# EAGLE design LM2596ADJ (EAGLE 6.4)
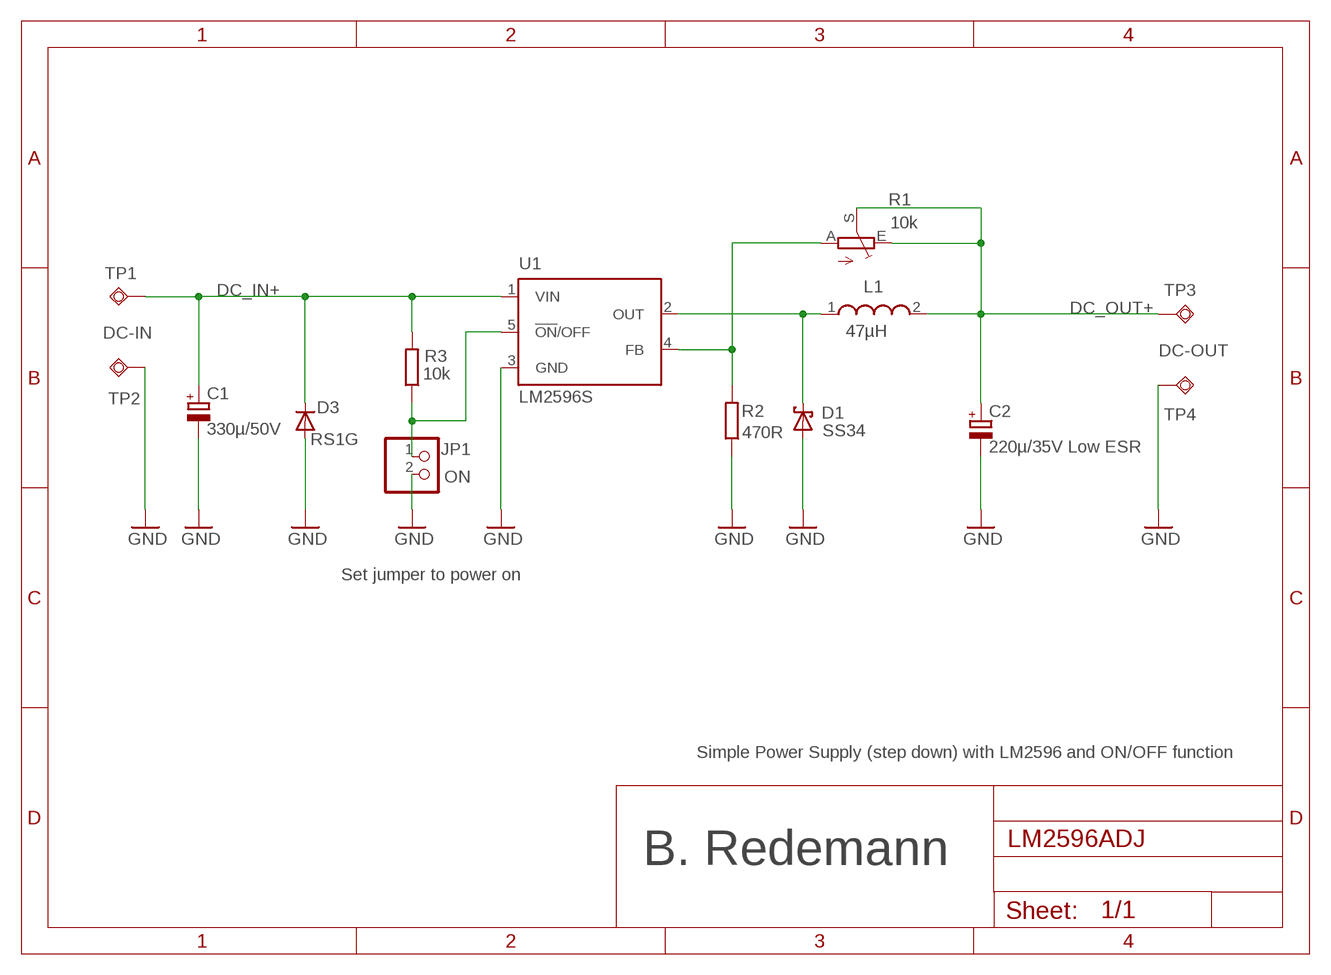
[diagram p0: schematic, sheet 1]

## Parts
C1  330µ/50V  CPOL-EUG  [PANASONIC_G]
C2  220µ/35V Low ESR  CPOL-EUF  [PANASONIC_F]
D1  SS34  SCHOTTKY-DIODESMD  [SMB]
D3  RS1G  DIODE-DO214AC  [DO214AC]
JP1  ON  PINHD-1X2  [1X02]
L1  47µH  WE-PD_1260/1245/1280/1210  [WE-PD_1260/1245/1280/1210]
R1  10k  TRIM_EU-RJ9W  [RJ9W]
R2  470R  R-EU_M0805  [M0805]
R3  10k  R-EU_M0805  [M0805]
TP1  DC_IN  TPSQPAD1-13Y  [P1-13Y]
TP2  GND  TPSQPAD1-13Y  [P1-13Y]
TP3  DC_OUT  TPSQPAD1-13Y  [P1-13Y]
TP4  GND  TPSQPAD1-13Y  [P1-13Y]
U1  LM2596S  [TO263-5]

## Nets
DC_IN+: C1.+ D3.C R3.2 TP1.TP U1.1(VIN)
DC_OUT+: C2.+ L1.2 R1.E R1.S TP3.TP
GND: C1.- C2.- D1.A D3.A JP1.2 R2.1 TP2.TP TP4.TP U1.3(GND)
N$1: D1.C L1.1 U1.2(OUT)
N$4: R1.A R2.2 U1.4(FB)
N$5: JP1.1 R3.1 U1.5(!ON!/OFF)

## Notes on the sheet
- DC-IN
- DC-OUT
- Set jumper to power on
- Simple Power Supply (step down) with LM2596 and ON/OFF function
- B. Redemann

## Library data of the parts
C1 = rcl:CPOL-EU: POLARIZED CAPACITOR, European symbol; MF: Panasonic; MFN: EEVFK1H221P
C2 = rcl:CPOL-EU: POLARIZED CAPACITOR, European symbol; MF: Panasonic; MFN: EINTRAGEN!
D1 = diode:SCHOTTKY-DIODE: Schottky Diode
D3 = diode:DIODE-: DIODE; MF: multicomp; MFN: RS1G; OC_FARNELL: 4085035
JP1 = pinhead:PINHD-1X2: PIN HEADER
L1 = Wurth_Elektronik_Passive_rev15b:WE-PD: SMD Shielded Power Inductor Characteristics Magnetically shielded version which results in a low leakage field High Saturation currents up to 25 A Very low self-losses at high switching frequency‘s Wide inductances spectrum available at all sizes Operating temperature: –40 °C to +125 °C Applications Perfectly suitable for switching regulators with extremely high efficiency Integrated DC/DC- converter Switching regulators with low operating voltages (Graphic cards, embedded PC-Cards, Mainboards) Plastic base: Because of the one piece construction these are more suitable for high vibration or shock applications <http://katalog.we-online.de/media/images/eisos/FePBF_pf2.jpg> Details see: http://katalog.we-online.de/en/pbs/WE-PD? Updated by Dan Xu 2014-07-08 2014 (C) Wurth Elektronik; MF: Wuerth
R1 = pot:TRIM_EU-: POTENTIOMETER
R2 R3 = rcl:R-EU_: RESISTOR, European symbol
TP1-TP4 = testpad:TPSQ: Test pad
U1 = national-semiconductor:LM2596: SIMPLE SWITCHER® Power Converter 150 kHz 3A Step-Down Voltage Regulator Source: http://www.national.com/ds/LM/LM2596.pdf; MF: NATIONAL SEMICONDUCTOR; MPN: LM2596S-ADJ/NOPB; OC_FARNELL: 9494367; OC_NEWARK: 41K3842

## Board
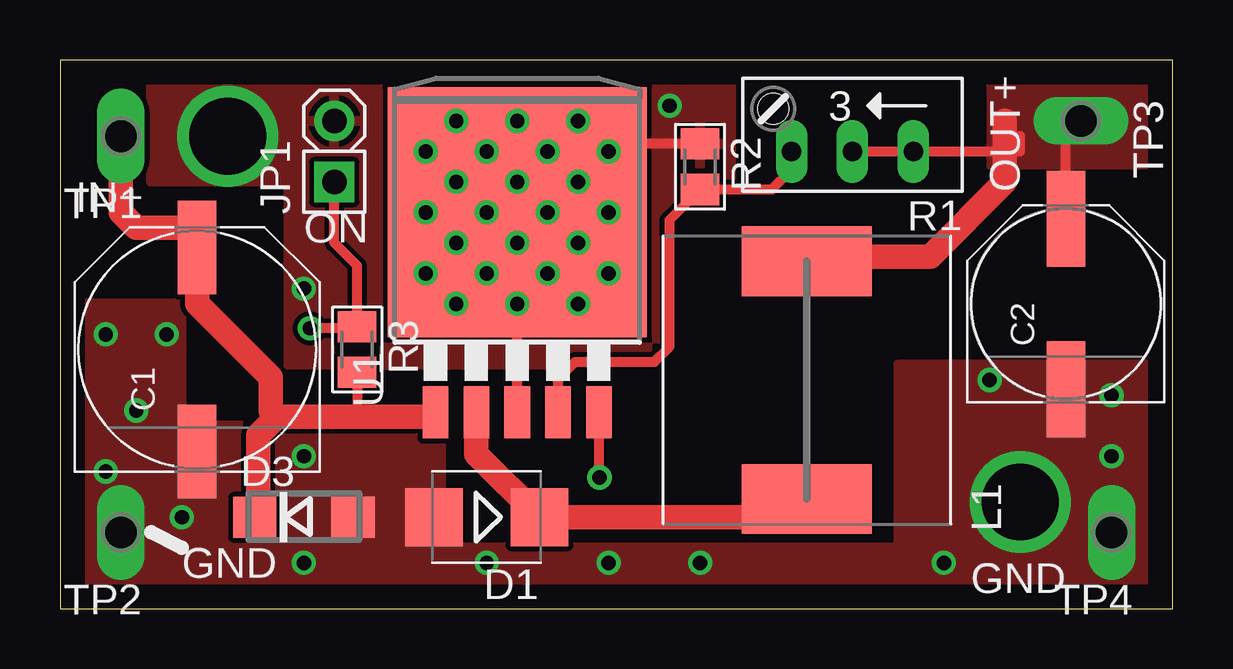
[diagram p1: board, top side]
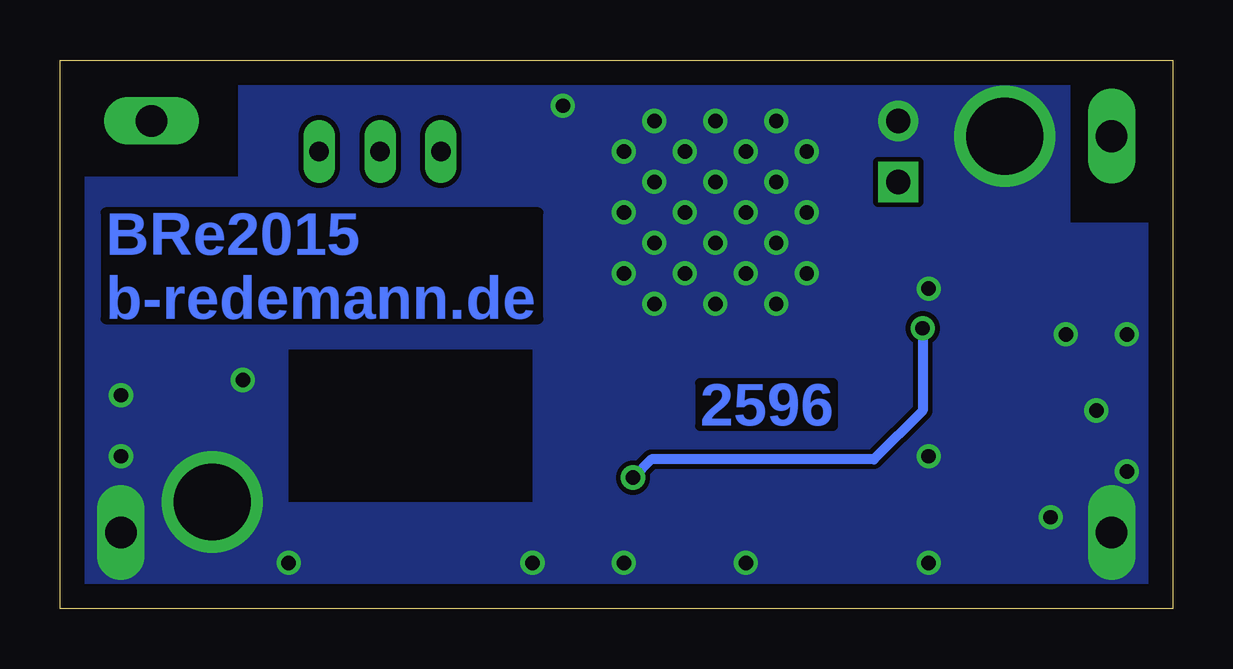
[diagram p2: board, bottom side, seen from below]

Size 46.35 x 22.86 mm. Coordinates in mm from the lower left corner, seen from the top.
Outline: 0,0 46.35,0 46.35,22.86 0,22.86 0,0
Copper layers (1*16): Top 0.035mm / dielectric 1.5mm / Bottom 0.035mm
Design rules "default *": minimum track width 10mil, minimum drill 0.6mm, track to track 8mil, track to pad 8mil, pad to pad 8mil, via to via 8mil, smd to smd 8mil, copper to edge 40mil, drill to drill 8mil, minimum pad ring 10mil, minimum via ring 8mil, stop-mask expansion 4mil, vias tented up to drill 0mil, thermal gap 10mil
bRestrict: area 26.7,4.4 to 36.8,10.8

### Footprints (pad centres in the part's own frame; a part is rotated, then mirrored left to right if it is on the bottom)
PANASONIC_G = smd 3.9 x 1.6: + 4.25,0; - -4.25,0
PANASONIC_F = smd 4 x 1.6: + 3.55,0; - -3.55,0
SMB = smd 2.4 x 2.4: A 2.2,0; C -2.2,0
DO214AC = smd 1.8 x 1.7: A 2.05,0; C -2.05,0
1X02 = drill 1.016 pad 1.676 square: 1 -1.27,0 | drill 1.016 pad 1.676: 2 1.27,0
WE-PD_1260/1245/1280/1210 = smd 2.9 x 5.4: 1 -4.95,0; 2 4.95,0
RJ9W = drill 0.813 long: A 2.54,0.635; E -2.54,0.635; S 0,0.635
M0805 = smd 1.3 x 1.6: 1 -0.95,0; 2 0.95,0
P1-13Y = drill 1.321 pad 1.905 long: TP 0,0
TO263-5 = smd 1.067 x 2.159: 1 -3.404,-5.791; 2 -1.702,-5.791; 3 0,-5.791; 4 1.702,-5.791; 5 3.404,-5.791 | smd 10.8 x 10.41: GND 0,2.54

### Placement (x,y rotation side)
C1  5.71,10.79 90 top
C2  41.91,12.7 90 top
D1  17.78,3.81 180 top
D3  10.16,3.81 0 top
JP1  11.43,19.05 90 top
L1  31.11,9.53 90 top
R1  33.02,19.68 180 top
R2  26.67,18.41 270 top
R3  12.38,10.79 270 top
TP1  2.54,19.68 180 top
TP2  2.54,3.17 180 top
TP3  42.55,20.32 270 top
TP4  43.81,3.17 180 top
U1  19.05,13.97 0 top

### Tracks (layer width: path | path; a pad name or v marks a point on that pad's centre or on a via)
DC_IN+
  Top 0.406: R3.2 12.38,8
  Top 1.016: U1.1 15.65,8.61 15.62,8 12.38,8 9.03,8 | TP1.TP 2.54,16.51 3.17,15.88 5.52,15.88 C1.+ 5.71,12.7 8.78,9.64 8.78,8.26 9.03,8 | D3.C 8.26,3.81 8.26,7.22 9.03,8
DC_OUT+
  Top 0.406: R1.S R1.E 40.01,19.05 40.01,19.68 | C2.+ 41.91,19.68 TP3.TP
  Top 1.016: 39.37,20.32 39.37,17.78 36.25,14.66 31.11,14.66 L1.2
  pour Top (no thermals): 45.72,22.23 45.72,18.41 38.73,18.41 38.73,22.23
GND  (via drill 0.6, 3.2)
  Top 0.406: R2.1 23.81,19.36 v22.86,16.51 | U1.3 v19.05,12.7 v20.32,13.97
  other vias: 15.24,19.05 17.78,19.05 20.32,19.05 22.86,19.05 20.32,16.51 17.78,16.51 15.24,16.51 15.24,13.97 17.78,13.97 22.86,13.97 43.81,8.89 43.81,6.35 16.51,20.32 19.05,20.32 21.59,20.32 21.59,17.78 21.59,15.24 21.59,12.7 19.05,15.24 19.05,17.78 16.51,17.78 16.51,15.24 16.51,12.7 25.4,20.95 38.73,9.53 36.83,1.91 26.67,1.91 22.86,1.91 10.16,6.35 10.16,1.91 17.78,1.91 1.91,5.71 1.91,11.43 4.45,11.43 3.17,8.26 5.08,3.81 10.16,13.34 40.01,4.45 6.99,19.68
  pour Bottom (no thermals): 4.45,22.86 38.73,22.86 38.73,17.78 46.35,17.78 46.35,0 0,0 0,15.88 4.45,15.88
  pour Top (no thermals): 0,12.7 0,0 46.35,0 46.35,10.16 34.92,10.16 34.92,2.54 15.88,2.54 15.88,7.62 5.08,7.62 5.08,12.7
  pour Top: 3.81,22.86 27.94,22.86 27.94,16.51 24.77,16.51 24.77,10.16 9.53,10.16 9.53,17.78 3.81,17.78
N$1
  Top 1.016: U1.2 17.35,6.44 D1.C 31.06,3.81 L1.1
N$4
  Top 0.406: U1.4 20.75,9.58 21.46,10.29 24.77,10.29 25.4,10.92 25.4,16.2 R2.2 29.66,17.46 30.48,18.29 R1.A
N$5  (via drill 0.6)
  Top 0.406: JP1.1 11.43,15.24 12.38,14.29 R3.1 12.25,11.74 12.19,11.68 v10.41,11.68 | v22.48,5.46 22.48,8.15 U1.5
  Bottom 0.406: v10.41,11.68 10.41,8.26 12.45,6.22 21.72,6.22 v22.48,5.46

### Text on the board
Bottom: BRe2015 / b-redemann.de | 2596
tPlace: OUT+ | IN+ | ON | GND | GND